# EAGLE design Power Input Board (EAGLE 9.2.0)
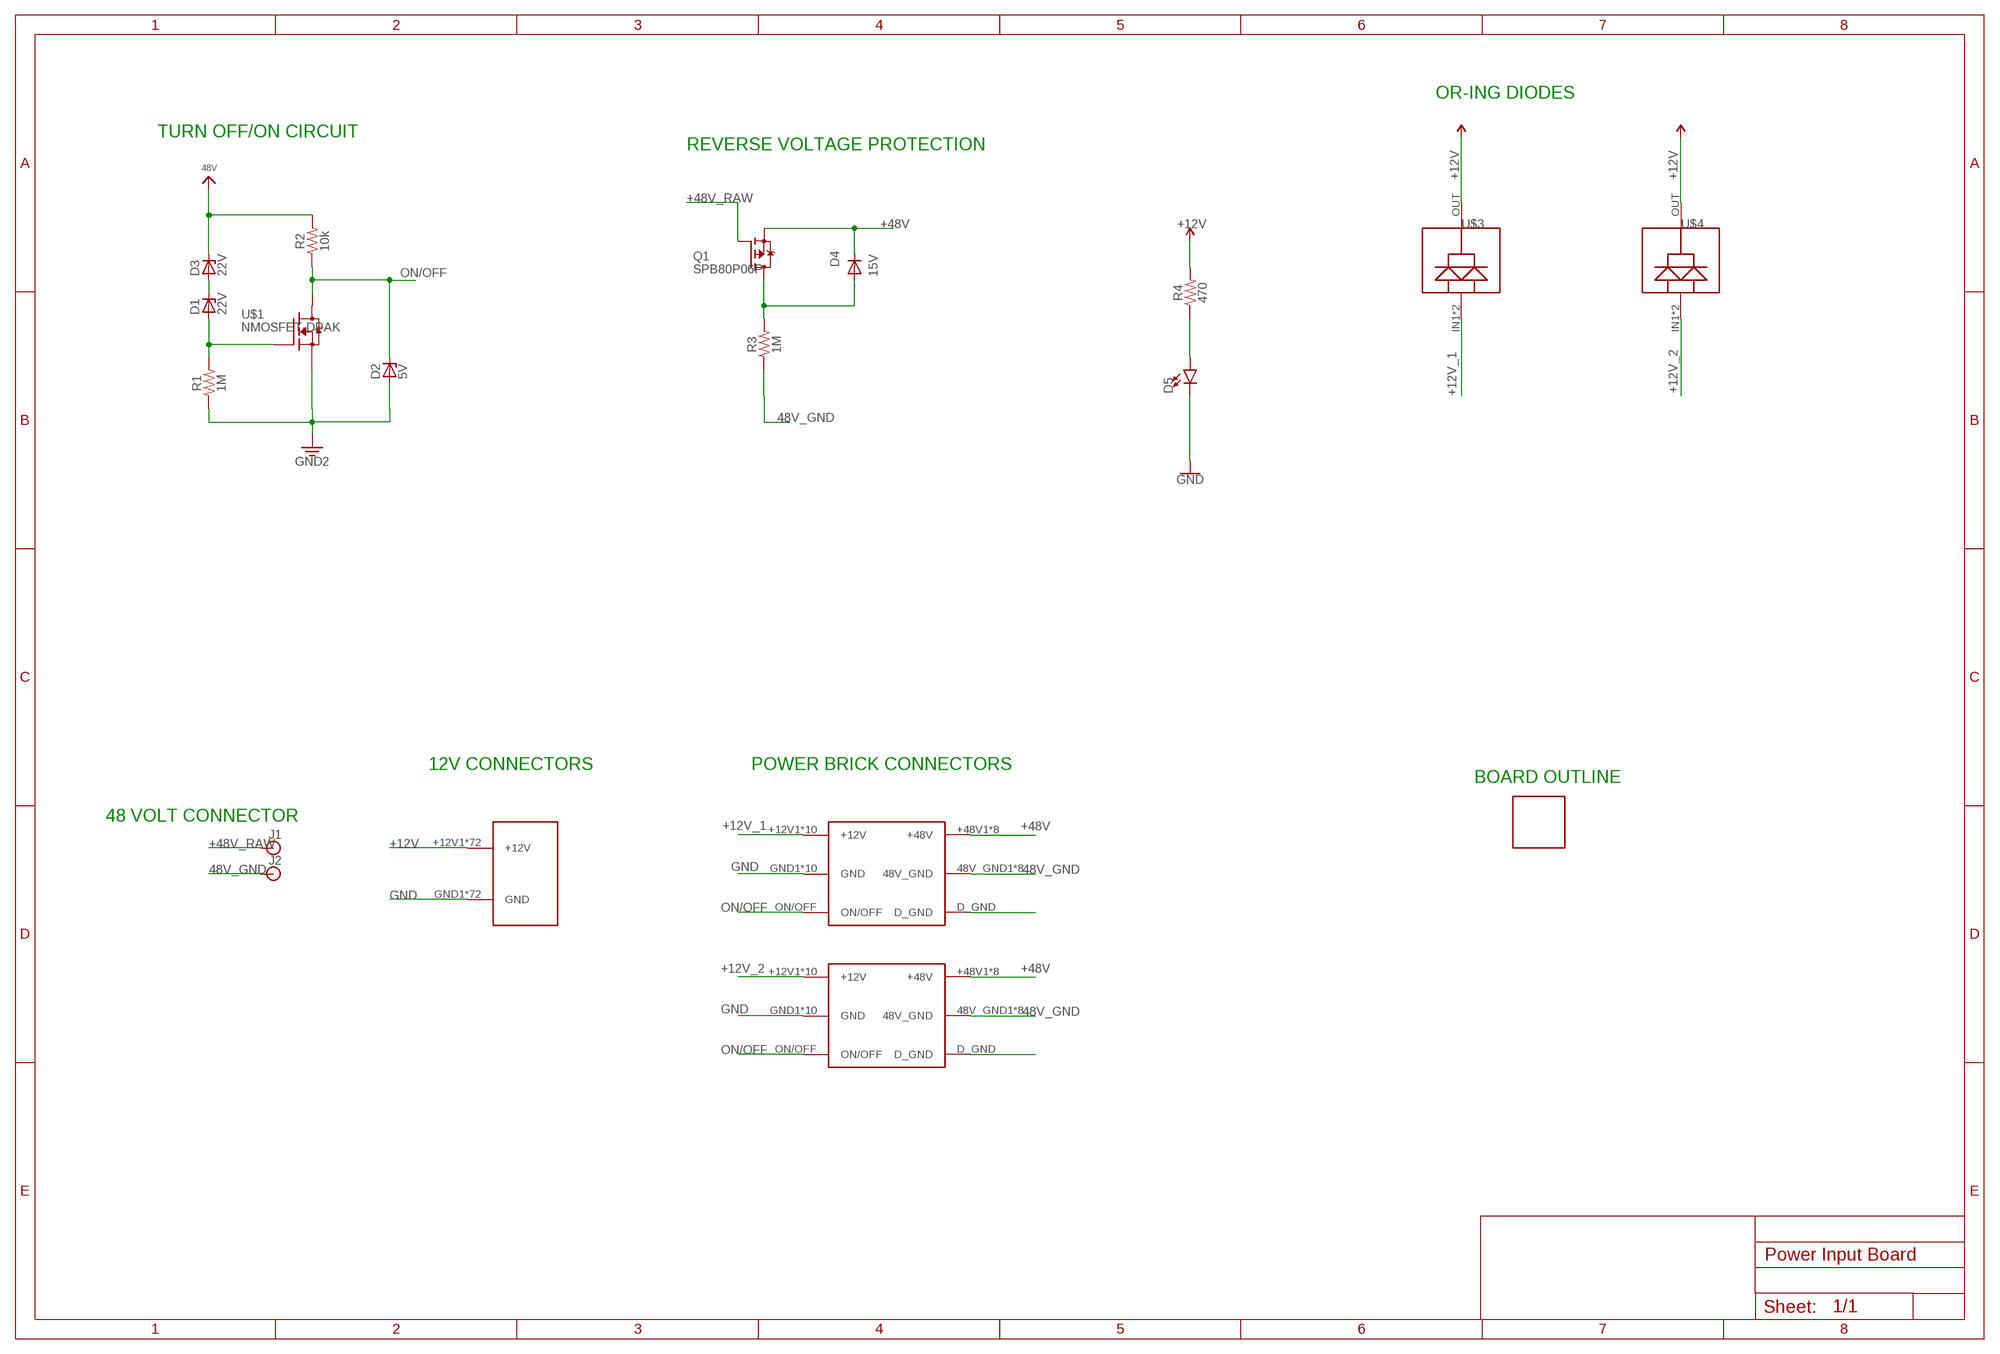
[diagram p0: schematic, sheet 1]

## Parts
D1  22V  ZENER-DIODESOT23  [SOT23]
D2  5V  ZENER-DIODESOT23  [SOT23]
D3  22V  ZENER-DIODESOT23  [SOT23]
D4  15V  DIODE-SOD123  [SOD123]
D5  LED0603  [LED-0603]
J1  BANANA_CONN  [BANANA_CONN]
J2  BANANA_CONN  [BANANA_CONN]
Q1  SPB80P06P  [TO263]
R1  1M  RESISTOR0603  [0603]
R2  10k  RESISTOR0603  [0603]
R3  1M  RESISTOR0603  [0603]
R4  470  RESISTOR0603  [0603]
U$1  NMOSFET-DPAK  [DPAK]
U$2  BOARDPDB  [PDB]
U$3  DIODE  [DIODE]
U$4  DIODE  [DIODE]
U$5  BRICK_TO_POWER_DIST_WHOLE  [BRICK_TO_POWER_DIST_WHOLE]
U$6  BRICK_TO_POWER_DIST_WHOLE  [BRICK_TO_POWER_DIST_WHOLE]
U$7  PDB_PCB_CONNEC  [PDB_PCB_2]

## Nets
3.3V: D2.1(A) R1.1 U$1.3(S) ; supply symbol labelled GND2
48V_GND: J2.P$1 R3.1 U$5.48V_GND1(48V_GND) U$5.48V_GND2(48V_GND) U$5.48V_GND3(48V_GND) U$5.48V_GND4(48V_GND) U$5.48V_GND5(48V_GND) U$5.48V_GND6(48V_GND) U$5.48V_GND7(48V_GND) U$5.48V_GND8(48V_GND) U$6.48V_GND1(48V_GND) U$6.48V_GND2(48V_GND) U$6.48V_GND3(48V_GND) U$6.48V_GND4(48V_GND) U$6.48V_GND5(48V_GND) U$6.48V_GND6(48V_GND) U$6.48V_GND7(48V_GND) U$6.48V_GND8(48V_GND)
+12V: R4.2 U$3.OUT U$4.OUT U$7.+12V1(+12V) U$7.+12V2(+12V) U$7.+12V3(+12V) U$7.+12V4(+12V) U$7.+12V5(+12V) U$7.+12V6(+12V) U$7.+12V7(+12V) U$7.+12V8(+12V) U$7.+12V9(+12V) U$7.+12V10(+12V) U$7.+12V11(+12V) U$7.+12V12(+12V) U$7.+12V13(+12V) U$7.+12V14(+12V) U$7.+12V15(+12V) U$7.+12V16(+12V) U$7.+12V17(+12V) U$7.+12V18(+12V) U$7.+12V19(+12V) U$7.+12V20(+12V) U$7.+12V21(+12V) U$7.+12V22(+12V) U$7.+12V23(+12V) U$7.+12V24(+12V) U$7.+12V25(+12V) U$7.+12V26(+12V) U$7.+12V27(+12V) U$7.+12V28(+12V) U$7.+12V29(+12V) U$7.+12V30(+12V) U$7.+12V31(+12V) U$7.+12V32(+12V) U$7.+12V33(+12V) U$7.+12V34(+12V) U$7.+12V35(+12V) U$7.+12V36(+12V) U$7.+12V37(+12V) U$7.+12V38(+12V) U$7.+12V39(+12V) U$7.+12V40(+12V) U$7.+12V41(+12V) U$7.+12V42(+12V) U$7.+12V43(+12V) U$7.+12V44(+12V) U$7.+12V45(+12V) U$7.+12V46(+12V) U$7.+12V47(+12V) U$7.+12V48(+12V) U$7.+12V49(+12V) U$7.+12V50(+12V) U$7.+12V51(+12V) U$7.+12V52(+12V) U$7.+12V53(+12V) U$7.+12V54(+12V) U$7.+12V55(+12V) U$7.+12V56(+12V) U$7.+12V57(+12V) U$7.+12V58(+12V) U$7.+12V59(+12V) U$7.+12V60(+12V) U$7.+12V61(+12V) U$7.+12V62(+12V) U$7.+12V63(+12V) U$7.+12V64(+12V) U$7.+12V65(+12V) U$7.+12V66(+12V) U$7.+12V67(+12V) U$7.+12V68(+12V) U$7.+12V69(+12V) U$7.+12V70(+12V) U$7.+12V71(+12V) U$7.+12V72(+12V)
+12V_1: U$3.IN1(IN2) U$3.IN2 U$5.+12V1(+12V) U$5.+12V2(+12V) U$5.+12V3(+12V) U$5.+12V4(+12V) U$5.+12V5(+12V) U$5.+12V6(+12V) U$5.+12V7(+12V) U$5.+12V8(+12V) U$5.+12V9(+12V) U$5.+12V10(+12V)
+12V_2: U$4.IN1(IN2) U$4.IN2 U$6.+12V1(+12V) U$6.+12V2(+12V) U$6.+12V3(+12V) U$6.+12V4(+12V) U$6.+12V5(+12V) U$6.+12V6(+12V) U$6.+12V7(+12V) U$6.+12V8(+12V) U$6.+12V9(+12V) U$6.+12V10(+12V)
+48V: D4.C Q1.2(S) U$5.+48V1(+48V) U$5.+48V2(+48V) U$5.+48V3(+48V) U$5.+48V4(+48V) U$5.+48V5(+48V) U$5.+48V6(+48V) U$5.+48V7(+48V) U$5.+48V8(+48V) U$6.+48V1(+48V) U$6.+48V2(+48V) U$6.+48V3(+48V) U$6.+48V4(+48V) U$6.+48V5(+48V) U$6.+48V6(+48V) U$6.+48V7(+48V) U$6.+48V8(+48V)
+48V_RAW: J1.P$1 Q1.1(G)
GND: D5.C U$5.GND1(GND) U$5.GND2(GND) U$5.GND3(GND) U$5.GND4(GND) U$5.GND5(GND) U$5.GND6(GND) U$5.GND7(GND) U$5.GND8(GND) U$5.GND9(GND) U$5.GND10(GND) U$6.GND1(GND) U$6.GND2(GND) U$6.GND3(GND) U$6.GND4(GND) U$6.GND5(GND) U$6.GND6(GND) U$6.GND7(GND) U$6.GND8(GND) U$6.GND9(GND) U$6.GND10(GND) U$7.GND1(GND) U$7.GND2(GND) U$7.GND3(GND) U$7.GND4(GND) U$7.GND5(GND) U$7.GND6(GND) U$7.GND7(GND) U$7.GND8(GND) U$7.GND9(GND) U$7.GND10(GND) U$7.GND11(GND) U$7.GND12(GND) U$7.GND13(GND) U$7.GND14(GND) U$7.GND15(GND) U$7.GND16(GND) U$7.GND17(GND) U$7.GND18(GND) U$7.GND19(GND) U$7.GND20(GND) U$7.GND21(GND) U$7.GND22(GND) U$7.GND23(GND) U$7.GND24(GND) U$7.GND25(GND) U$7.GND26(GND) U$7.GND27(GND) U$7.GND28(GND) U$7.GND29(GND) U$7.GND30(GND) U$7.GND31(GND) U$7.GND32(GND) U$7.GND33(GND) U$7.GND34(GND) U$7.GND35(GND) U$7.GND36(GND) U$7.GND37(GND) U$7.GND38(GND) U$7.GND39(GND) U$7.GND40(GND) U$7.GND41(GND) U$7.GND42(GND) U$7.GND43(GND) U$7.GND44(GND) U$7.GND45(GND) U$7.GND46(GND) U$7.GND47(GND) U$7.GND48(GND) U$7.GND49(GND) U$7.GND50(GND) U$7.GND51(GND) U$7.GND52(GND) U$7.GND53(GND) U$7.GND54(GND) U$7.GND55(GND) U$7.GND56(GND) U$7.GND57(GND) U$7.GND58(GND) U$7.GND59(GND) U$7.GND60(GND) U$7.GND61(GND) U$7.GND62(GND) U$7.GND63(GND) U$7.GND64(GND) U$7.GND65(GND) U$7.GND66(GND) U$7.GND67(GND) U$7.GND68(GND) U$7.GND69(GND) U$7.GND70(GND) U$7.GND71(GND) U$7.GND72(GND)
N$1: D1.3(C) D3.1(A)
N$2: D1.1(A) R1.2 U$1.1(G)
N$3: D4.A Q1.3(D) R3.2
N$4: D5.A R4.1
N$5: D3.3(C) R2.2 ; supply symbol labelled 48V
N$10: U$5.D_GND
N$13: U$6.D_GND
ON/OFF: D2.3(C) R2.1 U$1.4(D1) U$5.ON/OFF U$6.ON/OFF

## Notes on the sheet
- OR-ING DIODES
- TURN OFF/ON CIRCUIT
- REVERSE VOLTAGE PROTECTION
- 12V CONNECTORS | POWER BRICK CONNECTORS
- BOARD OUTLINE
- 48 VOLT CONNECTOR

## Library data of the parts
D1-D3 = diode:ZENER-DIODE: Z-Diode
D4 = diode:DIODE-: DIODE
D5 = SparkFun-LED:LED: LED (Generic) Standard schematic elements and footprints for 5mm, 3mm, 1206, and 0603 sized LEDs. Generic LEDs with no color specified.
J1 J2 = SparkFun-Connectors:BANANA_CONN: Through-hole Banana Jack Basic PTH connection for banana jack plugs SparkFun Products: Multimeter Kit <https://www.sparkfun.com/products/retired/10956> Banana to Alligator Cable <https://www.sparkfun.com/products/retired/509> Banana to Alligator Coax Cable <https://www.sparkfun.com/products/retired/508> Banana to Banana Cable <https://www.sparkfun.com/products/retired/507> Banana to IC Hook Cables <https://www.sparkfun.com/products/retired/506>
Q1 = transistor-fet:SPB80P06P: SIPMOS (R) Power-Transistor P-Channel, Enhancement mode Source: http://www.infineon.com/upload/Document/cmc_upload/documents/011/3685/SPP80P06P.pdf
R1-R3 = SparkFun-Resistors:RESISTOR: Generic Resistor Package; SPICEPREFIX: R
R4 = SparkFun-Resistors:RESISTOR: Generic Resistor Package
U$1 = MotherboardParts:NMOSFET-DPAK; PN-DIGI: 497-4329-1-ND; VDSS: 60V
U$2 = board_outlines:BOARD
U$3 U$4 = DIODE:DIODE
U$5 U$6 = PDB_TO_BRICKS:BRICK_TO_POWER_DIST_WHOLE
U$7 = PDB_PCB_connectors:PDB_PCB_CONNEC

## Board
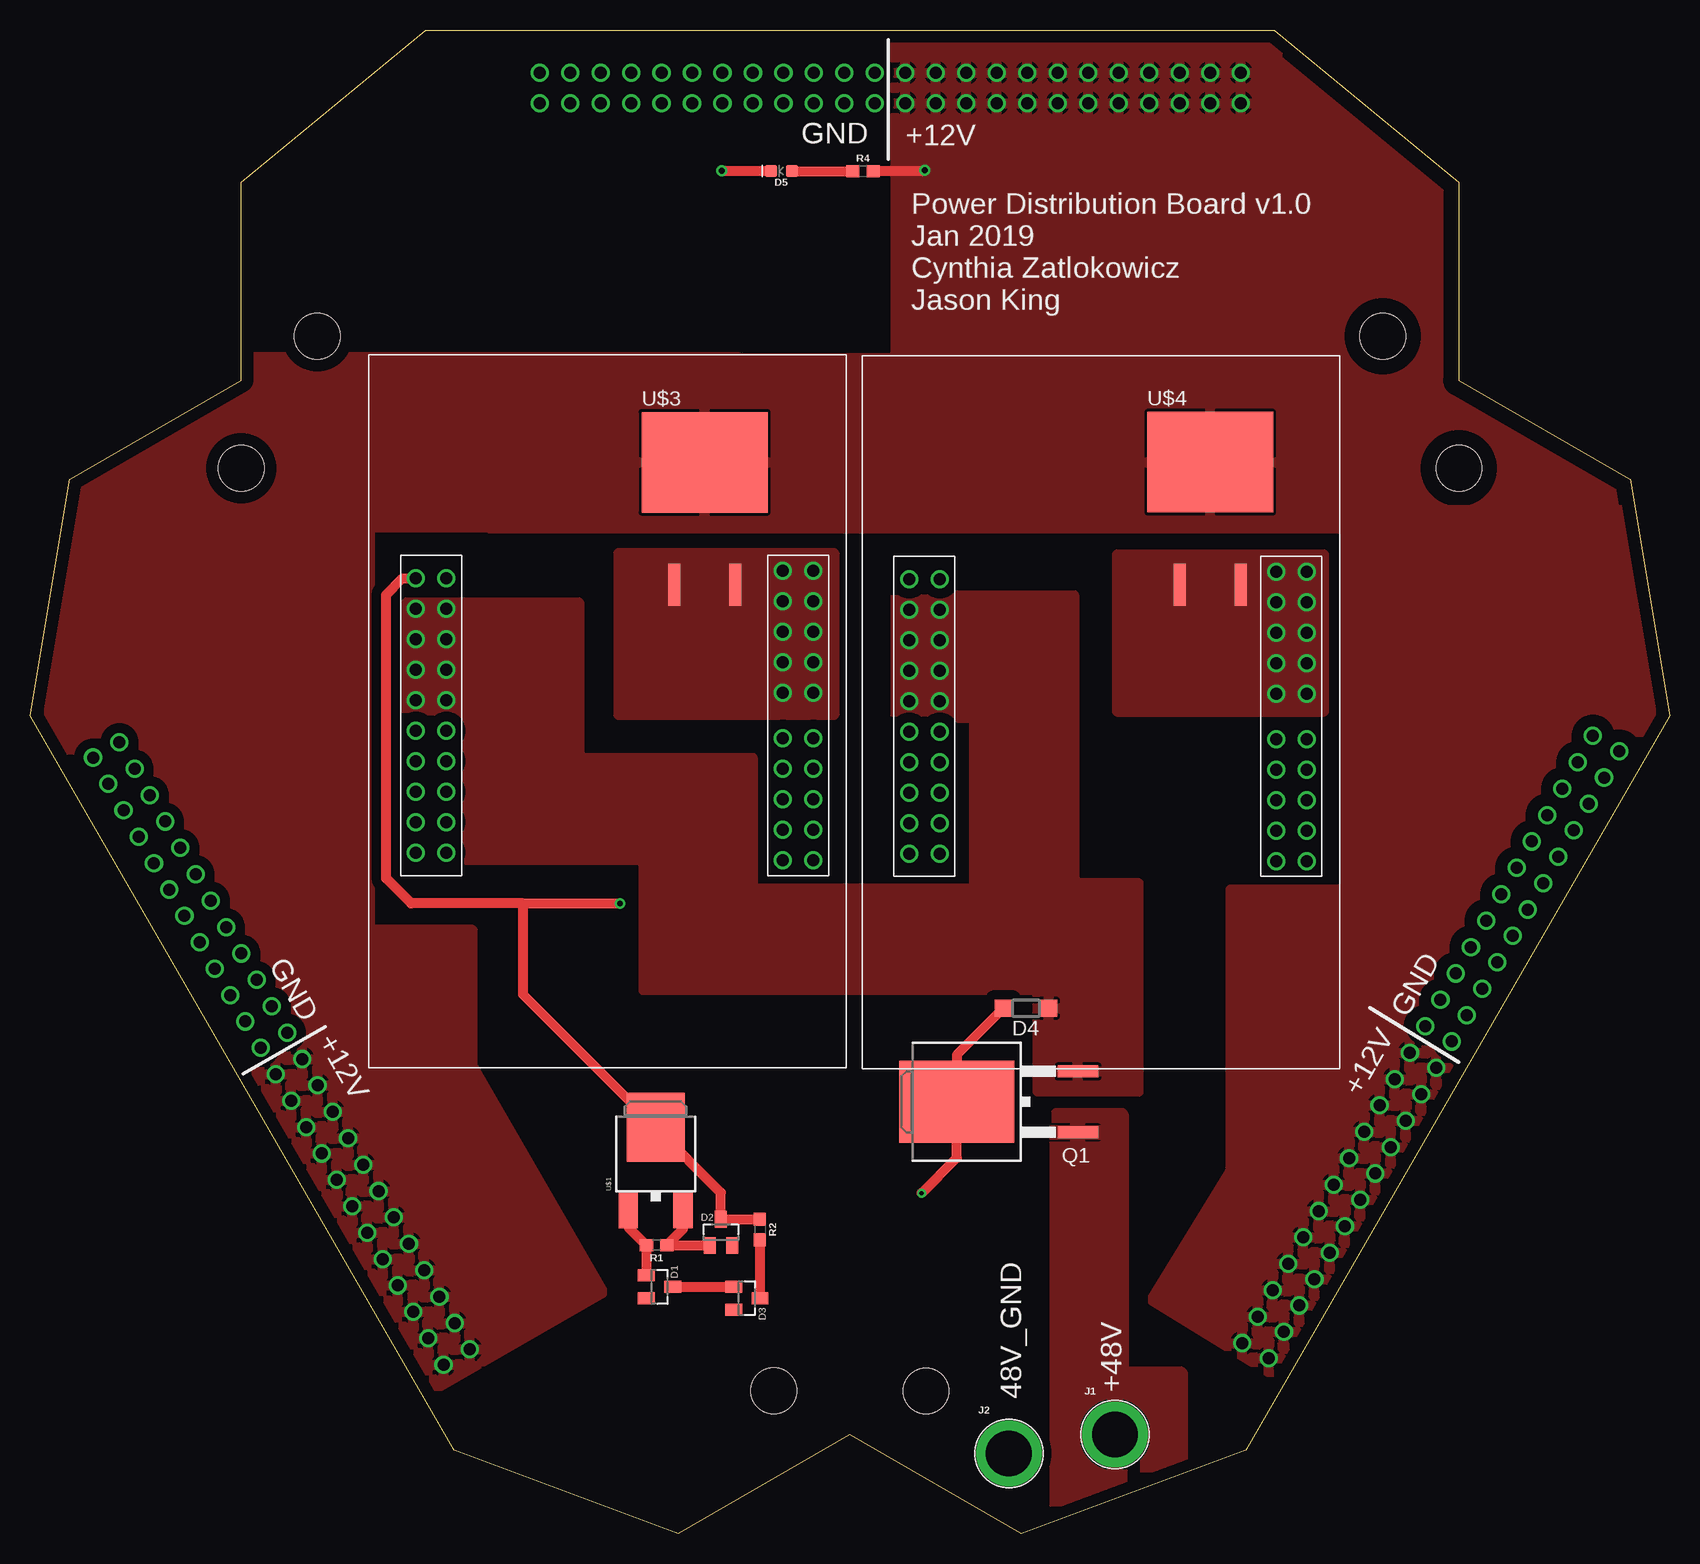
[diagram p1: board, top side]
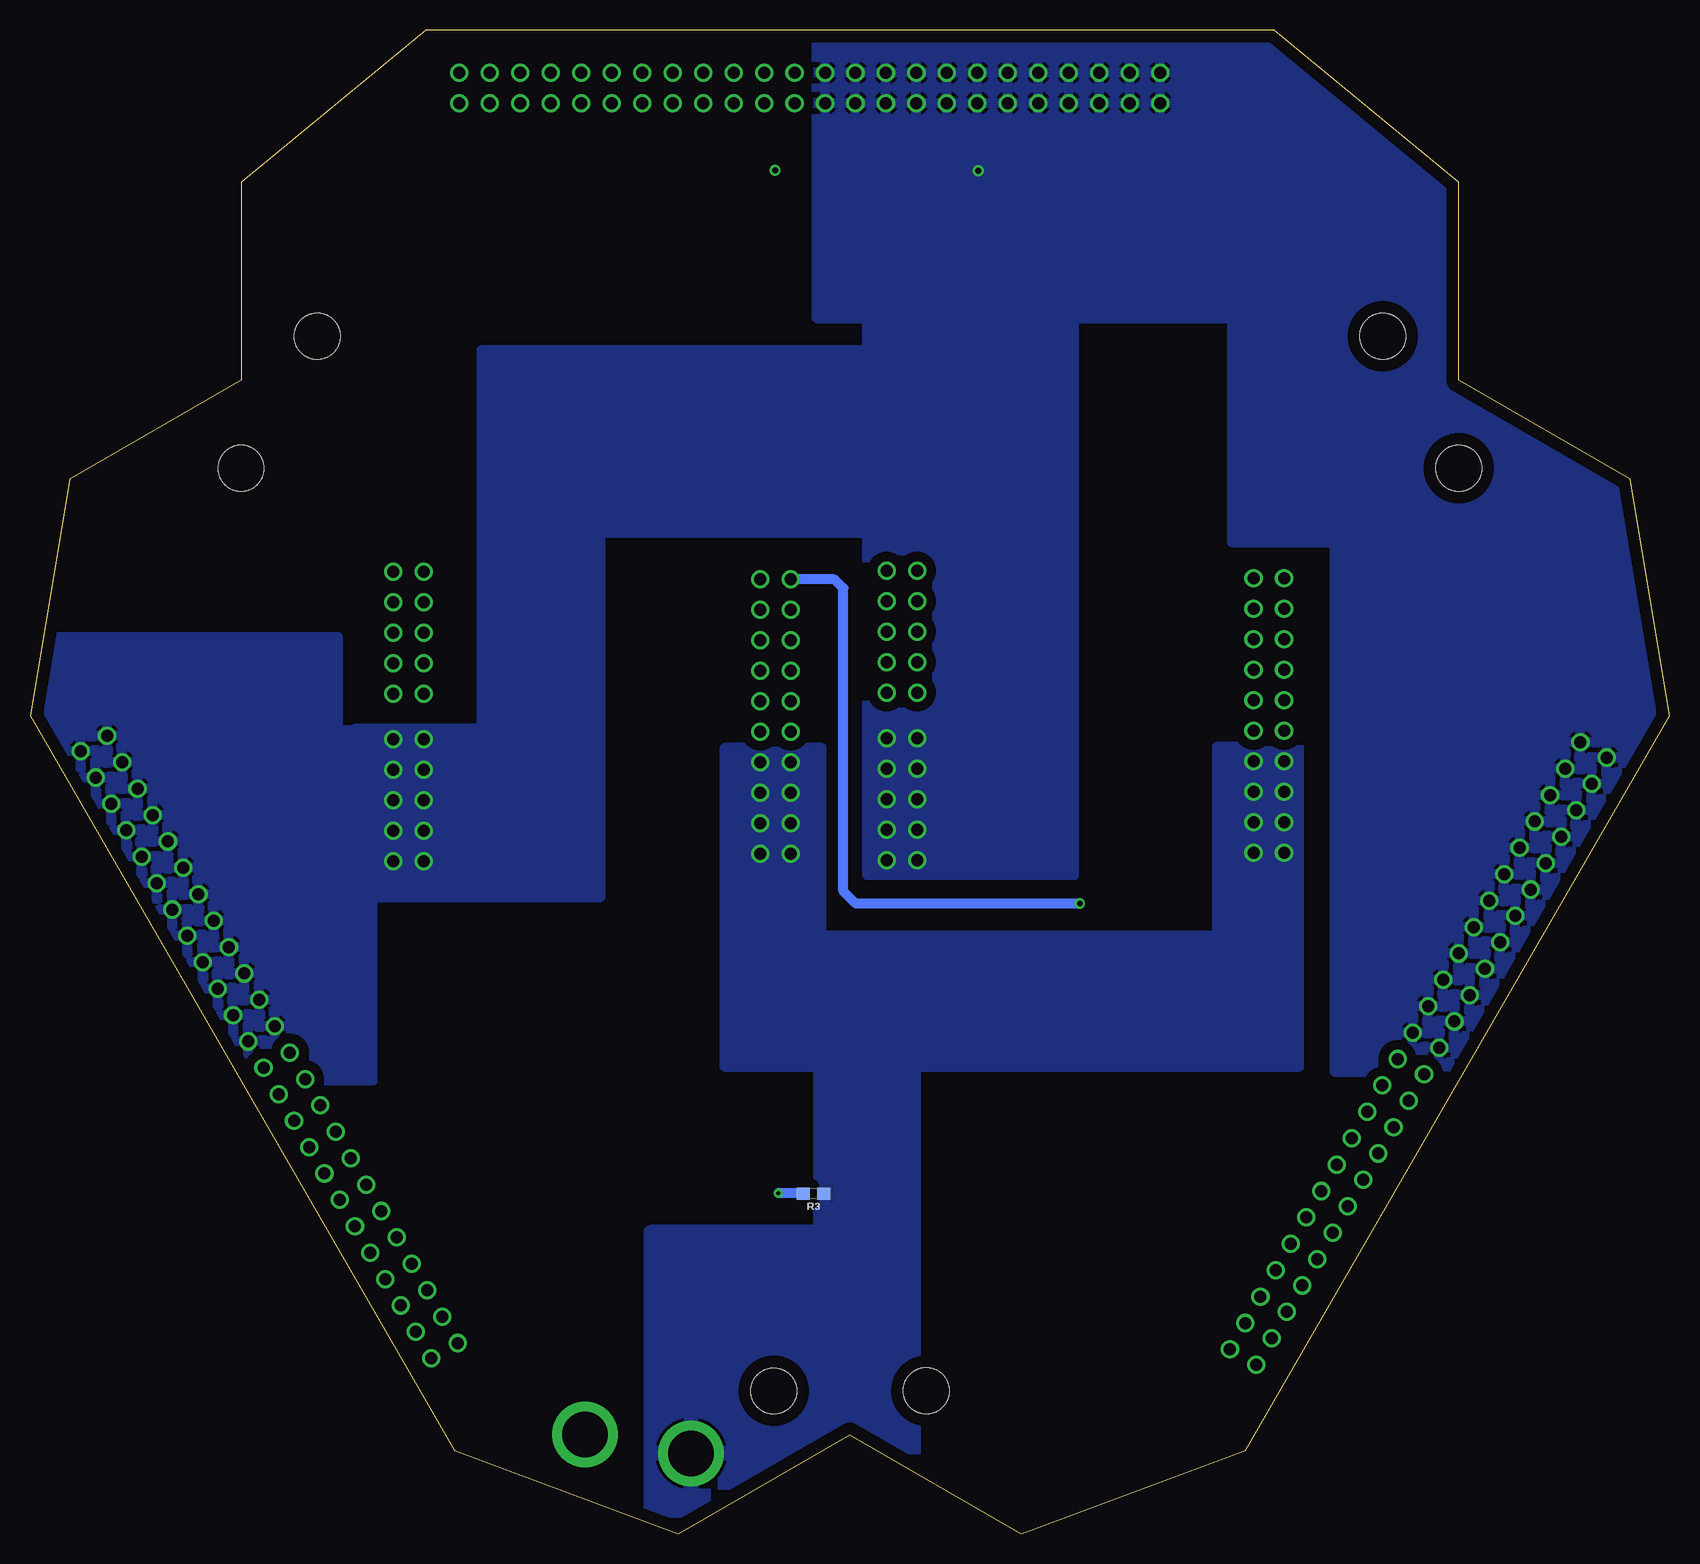
[diagram p2: board, bottom side, seen from below]

Size 136.66 x 125.33 mm. Coordinates in mm from the lower left corner, seen from the top.
Copper layers (1*16): Top 0.035mm / dielectric 1.5mm / Bottom 0.035mm
Design rules "default": minimum track width 6mil, minimum drill 0.35mm, track to track 6mil, track to pad 6mil, pad to pad 6mil, via to via 6mil, smd to smd 6mil, copper to edge 40mil, drill to drill 6mil, minimum pad ring 10mil, minimum via ring 8mil, stop-mask expansion 4mil, vias tented up to drill 0mil, thermal gap 10mil

### Footprints (pad centres in the part's own frame; a part is rotated, then mirrored left to right if it is on the bottom)
SOT23 = smd 1 x 1.4: 1 -0.95,-1.1; 2 0.95,-1.1; 3 0,1.1
SOD123 = smd 1.4 x 1.4: A 1.9,0; C -1.9,0
LED-0603 = smd 1 x 1: A -0.877,0; C 0.877,0
BANANA_CONN = drill 3.81 pad 5.461: P$1 0,0
TO263 = smd 1 x 3.4: 1 -2.54,-6.6; 2 2.54,-6.6 | smd 6.8 x 9.6: 3 0,3.5
0603 = smd 1.1 x 1: 1 -0.85,0; 2 0.85,0
DPAK = smd 1.6 x 3: 1 -2.28,-5.31; 3 2.28,-5.31 | smd 4.826 x 5.715: 4 0,1.588
PDB = hole 3.797: 23.927,99.797; 17.602,88.798; 112.725,99.797; 119.075,88.798; 74.676,11.913; 61.976,11.938
DIODE = smd 1.016 x 3.504: IN1 2.705,-6.023; IN2 7.785,-6.023 | smd 10.49 x 8.38: OUT 5.245,4.19
BRICK_TO_POWER_DIST_WHOLE = drill 1: 48V_GND1 36.405,6.47; 48V_GND2 38.945,6.47; 48V_GND3 36.405,3.93; 48V_GND4 38.945,3.93; 48V_GND5 33.865,3.93; 48V_GND6 33.865,6.47; 48V_GND7 41.485,3.93; 48V_GND8 41.485,6.47; +12V1 17.99,37.05; +12V2 20.53,37.05; +12V3 23.07,37.05; +12V4 25.61,37.05; +12V5 28.15,37.05; +12V6 17.99,34.51; +12V7 20.53,34.51; +12V8 23.07,34.51; +12V9 25.61,34.51; +12V10 28.15,34.51; +48V1 26.245,6.47; +48V2 28.785,6.47; +48V3 26.245,3.93; +48V4 28.785,3.93; +48V5 23.705,6.47; +48V6 23.705,3.93; +48V7 21.165,3.93; +48V8 21.165,6.47; D_GND 18.625,6.47; GND1 31.96,37.05; GND2 34.5,37.05; GND3 37.04,37.05; GND4 39.58,37.05; GND5 42.12,37.05; GND6 31.96,34.51; GND7 34.5,34.51; GND8 37.04,34.51; GND9 39.58,34.51; GND10 42.12,34.51; ON/OFF 18.625,3.93; P$31 31.325,3.93; P$36 31.325,6.47
PDB_PCB_2 = drill 1: +12V1 34.462,14.105; +12V2 36.662,15.375; +12V3 33.192,16.305; +12V4 35.392,17.575; +12V5 31.922,18.505; +12V6 34.122,19.775; +12V7 30.652,20.705; +12V8 32.852,21.975; +12V9 29.382,22.904; +12V10 31.582,24.174; +12V11 28.112,25.104; +12V12 30.312,26.374; +12V13 26.842,27.304; +12V14 29.042,28.574; +12V15 25.572,29.503; +12V16 27.772,30.773; +12V17 24.302,31.703; +12V18 26.502,32.973; +12V19 23.032,33.903; +12V20 25.232,35.173; +12V21 21.762,36.103; +12V22 23.962,37.373; +12V23 20.492,38.302; +12V24 22.692,39.572; +12V25 103.23,14.638; +12V26 101.03,15.908; +12V27 104.5,16.838; +12V28 102.3,18.108; +12V29 105.77,19.038; +12V30 103.57,20.308; +12V31 107.04,21.237; +12V32 104.84,22.507; +12V33 108.31,23.437; +12V34 106.11,24.707; +12V35 109.58,25.637; +12V36 107.38,26.907; +12V37 110.85,27.836; +12V38 108.65,29.106; +12V39 112.12,30.036; +12V40 109.92,31.306; +12V41 113.39,32.236; +12V42 111.19,33.506; +12V43 114.66,34.436; +12V44 112.46,35.706; +12V45 115.93,36.635; +12V46 113.73,37.905; +12V47 117.2,38.835; +12V48 115,40.105; +12V49 100.888,119.236; +12V50 100.888,121.776; +12V51 98.348,119.236; +12V52 98.348,121.776; +12V53 95.808,119.236; +12V54 95.808,121.776; +12V55 93.268,119.236; +12V56 93.268,121.776; +12V57 90.728,119.236; +12V58 90.728,121.776; +12V59 88.188,119.236; +12V60 88.188,121.776; +12V61 85.648,119.236; +12V62 85.648,121.776; +12V63 83.108,119.236; +12V64 83.108,121.776; +12V65 80.568,119.236; +12V66 80.568,121.776; +12V67 78.028,119.236; +12V68 78.028,121.776; +12V69 75.488,119.236; +12V70 75.488,121.776; +12V71 72.948,119.236; +12V72 72.948,121.776; GND1 19.222,40.502; GND2 21.422,41.772; GND3 17.952,42.702; GND4 20.152,43.972; GND5 16.682,44.901; GND6 18.882,46.171; GND7 15.412,47.101; GND8 17.612,48.371; GND9 14.142,49.301; GND10 16.342,50.571; GND11 12.872,51.5; GND12 15.072,52.77; GND13 11.602,53.7; GND14 13.802,54.97; GND15 10.332,55.9; GND16 12.532,57.17; GND17 9.062,58.1; GND18 11.262,59.37; GND19 7.792,60.299; GND20 9.992,61.569; GND21 6.522,62.499; GND22 8.722,63.769; GND23 5.252,64.699; GND24 7.452,65.969; GND25 118.47,41.035; GND26 116.27,42.305; GND27 119.74,43.234; GND28 117.54,44.504; GND29 121.01,45.434; GND30 118.81,46.704; GND31 122.28,47.634; GND32 120.08,48.904; GND33 123.55,49.834; GND34 121.35,51.104; GND35 124.82,52.033; GND36 122.62,53.303; GND37 126.09,54.233; GND38 123.89,55.503; GND39 127.36,56.433; GND40 125.16,57.703; GND41 128.63,58.632; GND42 126.43,59.902; GND43 129.9,60.832; GND44 127.7,62.102; GND45 131.17,63.032; GND46 128.97,64.302; GND47 132.44,65.231; GND48 130.24,66.501; GND49 70.408,119.236; GND50 70.408,121.776; GND51 67.868,119.236; GND52 67.868,121.776; GND53 65.328,119.236; GND54 65.328,121.776; GND55 62.788,119.236; GND56 62.788,121.776; GND57 60.248,119.236; GND58 60.248,121.776; GND59 57.708,119.236; GND60 57.708,121.776; GND61 55.168,119.236; GND62 55.168,121.776; GND63 52.628,119.236; GND64 52.628,121.776; GND65 50.088,119.236; GND66 50.088,121.776; GND67 47.548,119.236; GND68 47.548,121.776; GND69 45.008,119.236; GND70 45.008,121.776; GND71 42.468,119.236; GND72 42.468,121.776

### Placement (x,y rotation side)
D1  52.46,20.59 270 top
D2  57.58,25.13 0 top
D3  59.74,19.65 270 top
D4  83,43.8 180 top
D5  62.61,113.56 180 top
J1  90.42,8.28 0 top
J2  81.57,6.7 0 top
Q1  80.73,36.01 90 top
R1  52.22,24.06 180 top
R2  60.83,25.37 270 top
R3  71.36,28.36 180 bottom
R4  69.42,113.56 0 top
U$1  52.14,32.3 0 top
U$2  0,0 0 top
U$3  50.98,85.11 0 top
U$4  93.11,85.13 0 top
U$5  28.23,98.26 270 top
U$6  69.34,98.18 270 top
U$7  0,0 0 top

### Tracks (layer width: path | path; a pad name or v marks a point on that pad's centre or on a via)
3.3V
  Top 0.813: U$1.3 54.43,25.42 R1.1 56.59,24.06 D2.1
48V_GND
  pour Bottom (isolate 0.813, no thermals): 70.66,65.51 78.79,65.51 78.79,38.94 30.89,38.94 30.89,65.61 37.74,65.61 37.74,49.86 70.66,49.86
  pour Bottom (isolate 0.813): 70.79,40.03 70.79,25.12 84.94,25.12 84.94,1.5 63.02,1.5 63.02,40.03
+12V  (via drill 0.5)
  Top 0.813: v74.57,113.64 74.5,113.56 R4.2
  pour Top (isolate 0.813): 72.09,124.54 72.09,88.11 103.96,88.11 103.96,124.54
  pour Top (isolate 0.813): 38.38,97.99 108.99,97.99 108.99,83.74 38.38,83.74
  pour Top (isolate 1.27): 88.72,119.68 116.8,71.05 138.64,83.66 110.57,132.29
  pour Top (isolate 0.813): 93.43,19.51 103.46,13.35 118.38,39.2 108.99,44.87
  pour Top (isolate 1.016): 109.47,85.32 109.47,36.17 116.38,36.17 136.5,56.29 136.5,85.32
  pour Top (isolate 0.813): 18.38,38.9 32.27,46.92 47.75,20.1 33.86,12.09
  pour Top (isolate 0.813): 59,98.07 -5.23,98.07 -5.23,38.68 36.88,38.68 36.88,50.34 28.37,50.34 28.37,83.9 59,83.9
  pour Top (isolate 1.016): 120.78,53.7 100.03,53.7 100.03,30.56 120.78,30.56
+12V_1
  pour Top (isolate 0.813, no thermals): 49.05,81.76 67.01,81.76 67.01,68.22 49.05,68.22
+12V_2
  pour Top (isolate 0.813, no thermals): 107.85,81.61 90.58,81.61 90.58,68.53 107.85,68.53
+48V
  pour Top (isolate 0.813, no thermals): 31.06,77.62 45.77,77.62 45.77,64.69 60.22,64.69 60.22,53.8 78.69,53.8 78.69,67.97 72.16,67.97 72.16,78.23 87.02,78.23 87.02,45.29 51.13,45.29 51.13,56.13 31.06,56.13
  pour Top (isolate 0.813): 83.95,54.2 83.95,36.88 92.41,36.88 92.41,54.2
+48V_RAW
  pour Top (isolate 0.813): 85.62,34.9 90.93,34.9 90.93,13.34 95.86,13.34 95.86,0.71 85.62,0.71
GND  (via drill 0.5)
  Top 0.813: D5.C 57.66,113.56 v57.63,113.59
  pour Bottom (isolate 0.813): 32.51,124.56 71.12,124.56 71.12,101.32 32.51,101.32
  pour Bottom (isolate 0.813, no thermals): 49.63,113.28 66.93,113.28 66.93,54.91 49.63,54.91
  pour Bottom (isolate 0.813, no thermals): 99.06,67.08 109.63,67.08 109.63,53.06 89.1,53.06 89.1,83.41 54.18,83.41 54.18,98.63 99.06,98.63
  pour Bottom (isolate 0.813): 110.97,74.73 137.79,74.73 137.79,37.8 108.08,37.8 108.08,53.29 94.44,53.29 94.44,66.98 110.97,66.98
  pour Bottom (isolate 0.813): 27.97,38.53 -2.08,38.53 -2.08,124.43 36.53,124.43 36.53,82.65 27.97,82.65
N$1
  Top 0.813: D1.3 58.63,20.59 D3.1
N$2
  Top 0.813: U$1.1 49.86,25.57 R1.2 51.37,21.55 D1.1
N$3  (via drill 0.35)
  Top 0.813: D4.A 77.23,39.93 Q1.3 77.23,31.33 v74.3,28.4
  Bottom 0.813: R3.2 72.25,28.4 v74.3,28.4
N$4
  Top 0.813: D5.A R4.1
N$5
  Top 0.813: D3.3 R2.2
ON/OFF  (via drill 0.45)
  Top 0.813: R2.1 D2.3 57.58,28.45 U$1.4 41.1,44.93 41.1,52.55 | 41.1,52.55 31.75,52.55 29.67,54.63 29.67,78.26 31.04,79.63 U$5.ON/OFF | 41.1,52.55 49.15,52.55 v49.17,52.53
  Bottom 0.813: v49.17,52.53 67.84,52.53 68.89,53.57 68.89,78.82 69.62,79.56 U$6.ON/OFF

### Text on the board
tPlace: GND | +12V | Power Distribution Board v1.0 / Jan 2019 / Cynthia Zatlokowicz / Jason King | GND | GND | +12V | +12V | +48V | 48V_GND